# Altium schematic sheet 2寸屏幕转接板.SchDoc
size A4; Author: Ling; SheetNumber: 1; SheetTotal: 1; uSheetSize: A4; uProjectTitle: 2寸屏幕转接板; uSheetTitle: 2寸屏幕转接板; uData: 20250822; uVersion: 1.2
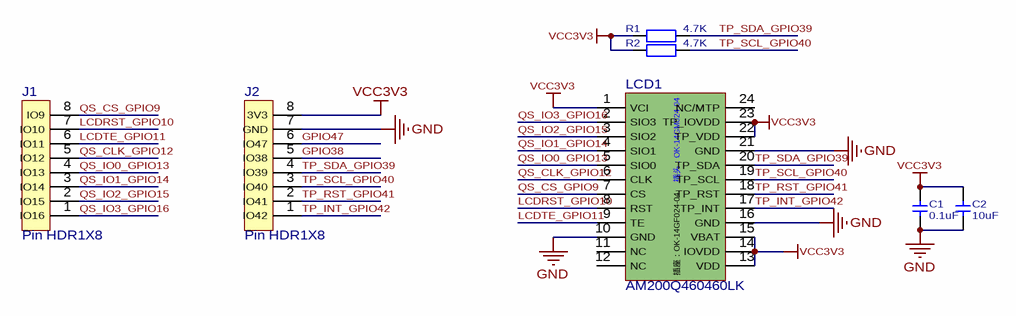
[diagram p0: 2寸屏幕转接板.SchDoc]

## Parts
C1  0.1uF  [CAP_0402 - G]
C2  10uF  [CAP_0402 - G]
J1  Pin HDR1X8  [HDR-SMD_8P-P2.54-V-M-LS4.8_XKB_R1]
J2  Pin HDR1X8  [HDR-SMD_8P-P2.54-V-M-LS4.8_XKB_R1]
LCD1  AM200Q460460LK  [2寸AMOLED]
R1  4.7K  [RES_0402 -G]
R2  4.7K  [RES_0402 -G]

## Nets
GND: C1.2 C2.2 J2.7(GND) LCD1.10(GND) LCD1.16(GND) LCD1.21(GND)
VCC3V3: C1.1 C2.1 J2.8(3V3) LCD1.1(VCI) LCD1.13(VDD) LCD1.14(IOVDD) LCD1.15(VBAT) LCD1.22(TP_VDD) LCD1.23(TP_IOVDD) R1.2 R2.2
GPIO38: J2.5(IO38)
GPIO47: J2.6(IO47)
LCDRST_GPIO10: J1.7(IO10) LCD1.8(RST)
LCDTE_GPIO11: J1.6(IO11) LCD1.9(TE)
QS_CLK_GPIO12: J1.5(IO12) LCD1.6(CLK)
QS_CS_GPIO9: J1.8(IO9) LCD1.7(CS)
QS_IO0_GPIO13: J1.4(IO13) LCD1.5(SIO0)
QS_IO1_GPIO14: J1.3(IO14) LCD1.4(SIO1)
QS_IO2_GPIO15: J1.2(IO15) LCD1.3(SIO2)
QS_IO3_GPIO16: J1.1(IO16) LCD1.2(SIO3)
TP_INT_GPIO42: J2.1(IO42) LCD1.17(TP_INT)
TP_RST_GPIO41: J2.2(IO41) LCD1.18(TP_RST)
TP_SCL_GPIO40: J2.3(IO40) LCD1.19(TP_SCL) R2.1
TP_SDA_GPIO39: J2.4(IO39) LCD1.20(TP_SDA) R1.1

Not connected (* = marked no-connect by the designer): LCD1 11(NC) 12(NC) 24(NC/MTP)

## Notes on the sheet
- Sheet Title
- Project Title
- Size
- Ver.
- Author
- Sheet
- /
- Data
- (in symbol AM200Q460460LK) 插头：OK-14GM024-04; 插座：OK-14GF024-04

## Library data of the parts
C1 C2 = CAP: Capacitor
LCD1 = AM200Q460460LK: 2.0寸AMOLED 460*460
R1 R2 = Res2: Resistor; Published: *; LatestRevisionDate: *; LatestRevisionNote: *; PackageReference: *; Publisher: *